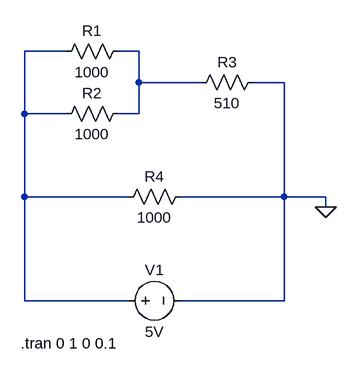
[diagram p0: schematic Draft1.asc]
Draft1.asc, the LTspice schematic file:
Version 4
SHEET 1 880 680
WIRE 80 48 16 48
WIRE 192 48 160 48
WIRE 192 96 192 48
WIRE 288 96 192 96
WIRE 416 96 368 96
WIRE 16 144 16 48
WIRE 80 144 16 144
WIRE 192 144 192 96
WIRE 192 144 160 144
WIRE 16 272 16 144
WIRE 176 272 16 272
WIRE 416 272 416 96
WIRE 416 272 256 272
WIRE 480 272 416 272
WIRE 480 288 480 272
WIRE 16 432 16 272
WIRE 176 432 16 432
WIRE 416 432 416 272
WIRE 416 432 256 432
FLAG 480 288 0
SYMBOL res 176 32 R90
WINDOW 0 0 56 VBottom 2
WINDOW 3 32 56 VTop 2
SYMATTR InstName R1
SYMATTR Value 1000
SYMBOL res 176 128 R90
WINDOW 0 0 56 VBottom 2
WINDOW 3 32 56 VTop 2
SYMATTR InstName R2
SYMATTR Value 1000
SYMBOL res 384 80 R90
WINDOW 0 0 56 VBottom 2
WINDOW 3 32 56 VTop 2
SYMATTR InstName R3
SYMATTR Value 510
SYMBOL res 272 256 R90
WINDOW 0 0 56 VBottom 2
WINDOW 3 32 56 VTop 2
SYMATTR InstName R4
SYMATTR Value 1000
SYMBOL voltage 160 432 R270
WINDOW 0 32 56 VTop 2
WINDOW 3 -32 56 VBottom 2
WINDOW 123 0 0 Left 0
WINDOW 39 0 0 Left 0
SYMATTR InstName V1
SYMATTR Value 5V
TEXT 10 498 Left 2 !.tran 0 1 0 0.1

The netlist it stands for:
* Draft1.asc
R1 N002 N001 1000
R2 N002 N001 1000
R3 0 N002 510
R4 0 N001 1000
V1 N001 0 5V
.tran 0 1 0 0.1
.backanno
.end